# Altium project Boxing.PrjPcb
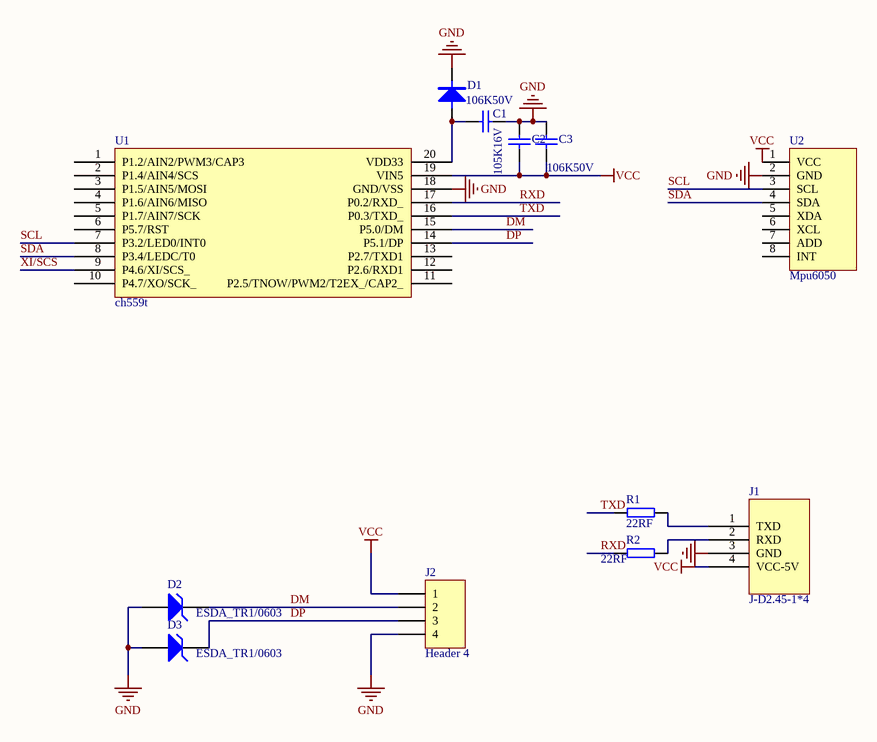
[diagram p0: boxing.SchDoc]
1 sheet, 12 parts. Net scope: global (net labels, ports and power ports of the same name join across sheets).

## Sheet boxing.SchDoc
size A4

### Parts
C1  106K50V  [C0603]
C2  105K16V  [C0603]
C3  106K50V  [C0603]
D1  500mA/13.2V  [D1206]  (value not drawn)
D2  ESDA_TR1/0603  [HS_0603D]
D3  ESDA_TR1/0603  [HS_0603D]
J1  J-D2.45-1*4  [D2.54-1*4P]
J2  Header 4  [USB-AB]
R1  22RF  [R0603]
R2  22RF  [R0603]
U1  ch559t  [SSOP-20]
U2  Mpu6050

### Nets
DGND: J1.3(GND)
GND: C1.1 C2.1 C3.1 D1.2 D2.1(A) D3.1(A) J2.4 U1.18(GND/VSS) U2.2(GND)
VCC: C2.2 C3.2 J1.4(VCC-5V) J2.1 U1.19(VIN5) U2.1(VCC)
DM: D2.2(K) J2.2 U1.15(P5.0/DM)
DP: D3.2(K) J2.3 U1.14(P5.1/DP)
RXD: R2.2 U1.17(P0.2/RXD_)
SCL: U1.7(P3.2/LED0/INT0) U2.3(SCL)
SDA: U1.8(P3.4/LEDC/T0) U2.4(SDA)
TXD: R1.2 U1.16(P0.3/TXD_)
XI/SCS: U1.9(P4.6/XI/SCS_)
NetC1_2: C1.2 D1.1 U1.20(VDD33)
NetJ1_1: J1.1(TXD) R1.1
NetJ1_2: J1.2(RXD) R2.1

Not connected (* = marked no-connect by the designer): U1 1(P1.2/AIN2/PWM3/CAP3) 2(P1.4/AIN4/SCS) 3(P1.5/AIN5/MOSI) 4(P1.6/AIN6/MISO) 5(P1.7/AIN7/SCK) 6(P5.7/RST) 10(P4.7/XO/SCK_) 11(P2.5/TNOW/PWM2/T2EX_/CAP2_) 12(P2.6/RXD1) 13(P2.7/TXD1); U2 5(XDA) 6(XCL) 7(ADD) 8(INT)

### Library data of the parts
C1 C3 = C0603X7R-106K50V: 贴片电容-陶瓷; 规格型号: 10uF±10%_50V_X7R_C0603; 生产商: 风华 三星; 供应商: *; 备注: *
C2 = C0603X7R-105K16V: 贴片电容-陶瓷; 规格型号: 1uF±10%_16V_X7R_C0603; 生产商: 风华 三星; 供应商: *; 备注: *
D1 = 1206MSD: 500mA/13.2V 自恢复保险丝
D2 D3 = D Zener: Zener Diode; Published: *; LatestRevisionDate: *; LatestRevisionNote: *; PackageReference: *; Publisher: *
J1 = J-D2.54-1*4单排排母
J2 = Header 4: Header, 4-Pin; LatestRevisionDate: 17-Jul-2002; LatestRevisionNote: Re-released for DXP Platform.; Publisher: Altium Limited
R1 R2 = R0603-22RF: 贴片电阻-通用; 生产商: 厚声 国巨; 规格型号: 22R±5%_1/10W_±200ppm_R0603; 货品编码: 无样品无编码; 备注: *; 供应商: *
U1 = CH559T: CH559T-20pin